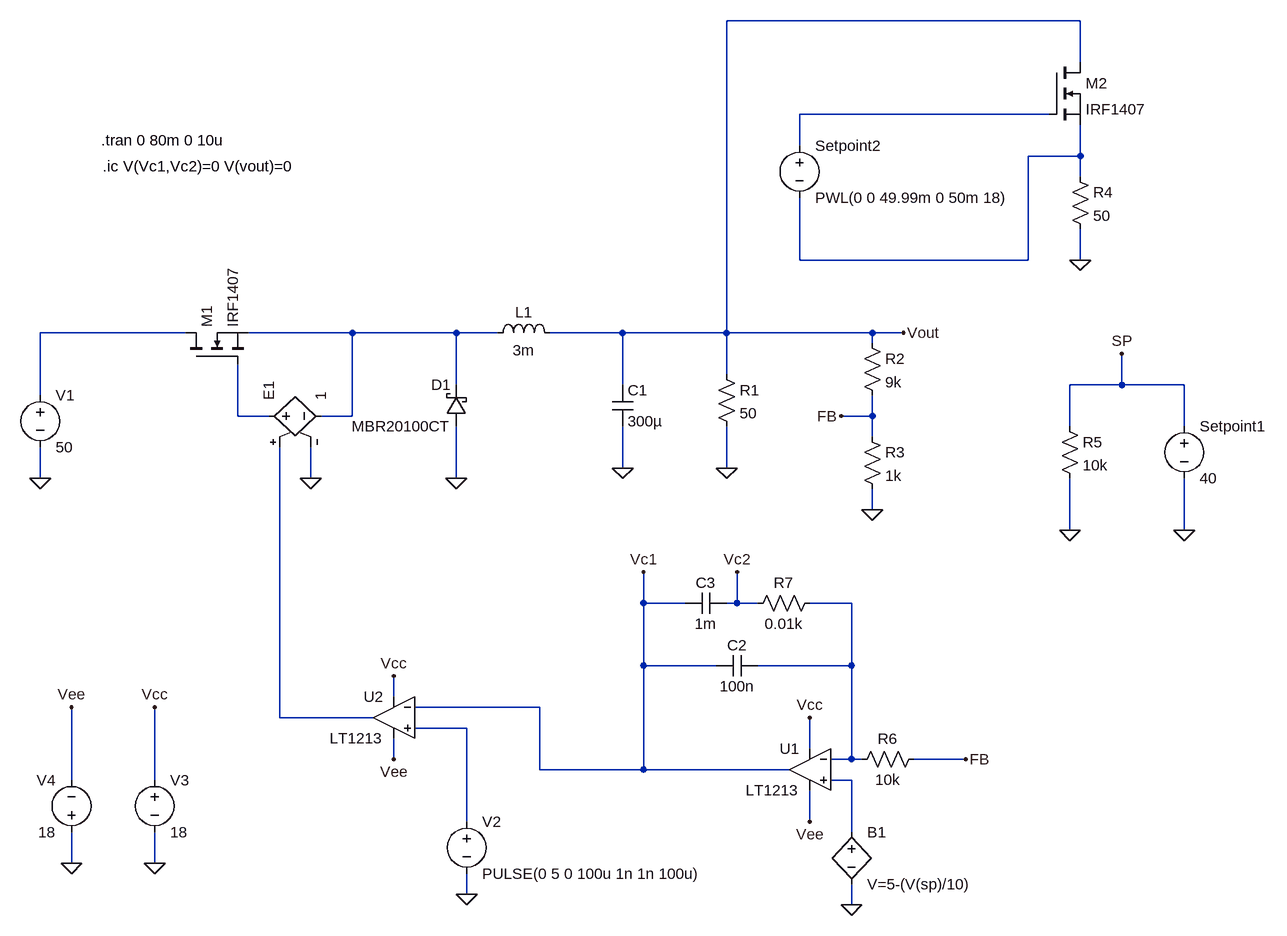
[diagram p0: schematic Closed-Loop Buck Converter.asc]
Closed-Loop Buck Converter.asc, the LTspice schematic file:
Version 4
SHEET 1 1196 680
WIRE 896 -1312 352 -1312
WIRE 896 -1248 896 -1312
WIRE 848 -1168 464 -1168
WIRE 464 -1120 464 -1168
WIRE 896 -1104 896 -1152
WIRE 896 -1104 816 -1104
WIRE 896 -1072 896 -1104
WIRE 464 -944 464 -1040
WIRE 816 -944 816 -1104
WIRE 816 -944 464 -944
WIRE 896 -944 896 -992
WIRE -480 -832 -704 -832
WIRE -224 -832 -384 -832
WIRE -64 -832 -224 -832
WIRE 0 -832 -64 -832
WIRE 192 -832 80 -832
WIRE 352 -832 352 -1312
WIRE 352 -832 192 -832
WIRE 576 -832 352 -832
WIRE 624 -832 576 -832
WIRE 576 -816 576 -832
WIRE 352 -768 352 -832
WIRE -64 -752 -64 -832
WIRE 192 -752 192 -832
WIRE 960 -752 960 -800
WIRE 960 -752 880 -752
WIRE 1056 -752 960 -752
WIRE -704 -736 -704 -832
WIRE -400 -704 -400 -784
WIRE -352 -704 -400 -704
WIRE -224 -704 -224 -832
WIRE -224 -704 -272 -704
WIRE 576 -704 576 -736
WIRE 576 -704 528 -704
WIRE 880 -688 880 -752
WIRE 1056 -688 1056 -752
WIRE 576 -672 576 -704
WIRE 192 -624 192 -688
WIRE 352 -624 352 -688
WIRE -704 -608 -704 -656
WIRE -288 -608 -288 -656
WIRE -64 -608 -64 -688
WIRE 576 -560 576 -592
WIRE 880 -528 880 -608
WIRE 1056 -528 1056 -608
WIRE 224 -416 224 -464
WIRE 288 -416 224 -416
WIRE 368 -416 368 -464
WIRE 368 -416 352 -416
WIRE 400 -416 368 -416
WIRE 544 -416 480 -416
WIRE 224 -320 224 -416
WIRE 336 -320 224 -320
WIRE 544 -320 544 -416
WIRE 544 -320 400 -320
WIRE -160 -272 -160 -304
WIRE 64 -256 -128 -256
WIRE -336 -240 -336 -656
WIRE -192 -240 -336 -240
WIRE -48 -224 -128 -224
WIRE 480 -192 480 -240
WIRE -160 -176 -160 -208
WIRE 544 -176 544 -320
WIRE 544 -176 512 -176
WIRE 560 -176 544 -176
WIRE 720 -176 640 -176
WIRE 64 -160 64 -256
WIRE 224 -160 224 -320
WIRE 224 -160 64 -160
WIRE 448 -160 224 -160
WIRE -656 -144 -656 -256
WIRE -528 -144 -528 -256
WIRE 544 -144 512 -144
WIRE -48 -80 -48 -224
WIRE 480 -80 480 -128
WIRE 544 -64 544 -144
WIRE -656 -16 -656 -64
WIRE -528 -16 -528 -64
WIRE -48 32 -48 0
WIRE 544 48 544 16
FLAG -288 -608 0
FLAG -64 -608 0
FLAG -704 -608 0
FLAG 192 -624 0
FLAG 352 -624 0
FLAG 576 -560 0
FLAG 624 -832 Vout
FLAG 528 -704 FB
FLAG 896 -944 0
FLAG 880 -528 0
FLAG 1056 -528 0
FLAG 960 -800 SP
FLAG 720 -176 FB
FLAG 224 -464 Vc1
FLAG 368 -464 Vc2
FLAG 544 48 0
FLAG 480 -240 Vcc
FLAG 480 -80 Vee
FLAG -160 -304 Vcc
FLAG -160 -176 Vee
FLAG -48 32 0
FLAG -528 -16 0
FLAG -656 -16 0
FLAG -528 -256 Vcc
FLAG -656 -256 Vee
SYMBOL voltage -704 -752 R0
WINDOW 123 0 0 Left 0
WINDOW 39 0 0 Left 0
SYMATTR InstName V1
SYMATTR Value 50
SYMBOL nmos -480 -784 R270
SYMATTR InstName M1
SYMATTR Value IRF1407
SYMBOL schottky -48 -688 R180
WINDOW 0 24 64 Left 2
WINDOW 3 24 0 Left 2
SYMATTR InstName D1
SYMATTR Value MBR20100CT
SYMATTR Description Diode
SYMATTR Type diode
SYMBOL e -368 -704 R270
SYMATTR InstName E1
SYMATTR Value 1
SYMBOL ind -16 -816 R270
WINDOW 0 32 56 VTop 2
WINDOW 3 5 56 VBottom 2
SYMATTR InstName L1
SYMATTR Value 3m
SYMBOL cap 176 -752 R0
SYMATTR InstName C1
SYMATTR Value 300µ
SYMBOL res 336 -784 R0
SYMATTR InstName R1
SYMATTR Value 50
SYMBOL res 560 -832 R0
SYMATTR InstName R2
SYMATTR Value 9k
SYMBOL res 560 -688 R0
SYMATTR InstName R3
SYMATTR Value 1k
SYMBOL nmos 848 -1248 R0
SYMATTR InstName M2
SYMATTR Value IRF1407
SYMBOL voltage 464 -1136 R0
WINDOW 123 0 0 Left 0
WINDOW 39 0 0 Left 0
SYMATTR InstName Setpoint2
SYMATTR Value PWL(0 0 49.99m 0 50m 18)
SYMBOL res 880 -1088 R0
SYMATTR InstName R4
SYMATTR Value 50
SYMBOL res 864 -704 R0
SYMATTR InstName R5
SYMATTR Value 10k
SYMBOL voltage 1056 -704 R0
WINDOW 123 0 0 Left 0
WINDOW 39 0 0 Left 0
SYMATTR InstName Setpoint1
SYMATTR Value 40
SYMBOL OpAmps\\LT1213 480 -224 M0
SYMATTR InstName U1
SYMBOL res 656 -192 R90
WINDOW 0 0 56 VBottom 2
WINDOW 3 32 56 VTop 2
SYMATTR InstName R6
SYMATTR Value 10k
SYMBOL bv 544 -80 R0
SYMATTR InstName B1
SYMATTR Value V=5-(V(sp)/10)
SYMBOL cap 400 -336 R90
WINDOW 0 0 32 VBottom 2
WINDOW 3 32 32 VTop 2
SYMATTR InstName C2
SYMATTR Value 100n
SYMBOL cap 352 -432 R90
WINDOW 0 0 32 VBottom 2
WINDOW 3 32 32 VTop 2
SYMATTR InstName C3
SYMATTR Value 1m
SYMBOL res 496 -432 R90
WINDOW 0 0 56 VBottom 2
WINDOW 3 32 56 VTop 2
SYMATTR InstName R7
SYMATTR Value 0.01k
SYMBOL OpAmps\\LT1213 -160 -304 M0
SYMATTR InstName U2
SYMBOL voltage -48 -96 R0
WINDOW 123 0 0 Left 0
WINDOW 39 0 0 Left 0
SYMATTR InstName V2
SYMATTR Value PULSE(0 5 0 100u 1n 1n 100u)
SYMBOL voltage -528 -160 R0
WINDOW 123 0 0 Left 0
WINDOW 39 0 0 Left 0
SYMATTR InstName V3
SYMATTR Value 18
SYMBOL voltage -656 -48 R180
WINDOW 0 24 96 Left 2
WINDOW 3 24 16 Left 2
WINDOW 123 0 0 Left 0
WINDOW 39 0 0 Left 0
SYMATTR InstName V4
SYMATTR Value 18
TEXT -608 -1088 Left 2 !.ic V(Vc1,Vc2)=0 V(vout)=0
TEXT -610 -1128 Left 2 !.tran 0 80m 0 10u

The netlist it stands for:
* Closed-Loop Buck Converter.asc
V1 N003 0 50
M1 N003 N005 N004 N004 IRF1407
D1 0 N004 MBR20100CT
E1 N005 N004 N007 0 1
L1 N004 Vout 3m
C1 Vout 0 300µ
R1 Vout 0 50
R2 Vout FB 9k
R3 FB 0 1k
M2 Vout N001 N002 N002 IRF1407
V§Setpoint2 N001 N002 PWL(0 0 49.99m 0 50m 18)
R4 N002 0 50
R5 SP 0 10k
V§Setpoint1 SP 0 40
XU1 N009 N006 Vcc Vee Vc1 LT1213  ; pins In+ In- V+ V- OUT
R6 FB N006 10k
B1 N009 0 V=5-(V(sp)/10)
C2 N006 Vc1 100n
C3 Vc2 Vc1 1m
R7 N006 Vc2 0.01k
XU2 N008 Vc1 Vcc Vee N007 LT1213  ; pins In+ In- V+ V- OUT
V2 N008 0 PULSE(0 5 0 100u 1n 1n 100u)
V3 Vcc 0 18
V4 0 Vee 18
.model D D
.lib standard.dio
.model NMOS NMOS
.model PMOS PMOS
.lib standard.mos
.ic V(Vc1,Vc2)=0 V(vout)=0
.tran 0 80m 0 10u
.lib LTC.lib
.backanno
.end